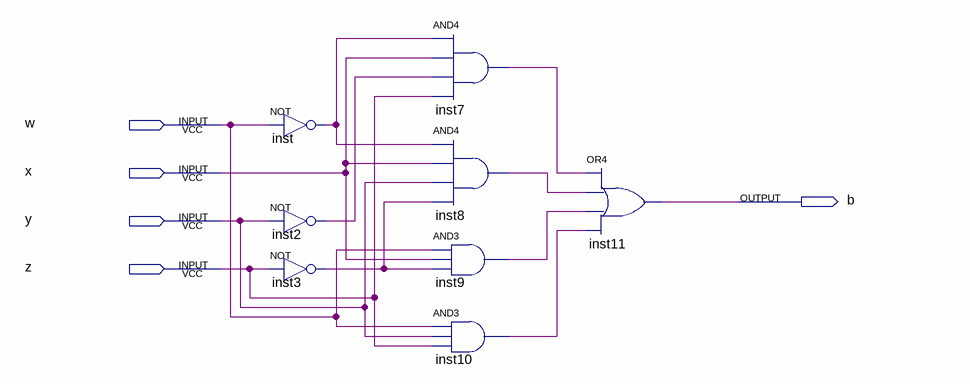
[diagram p0: schematic sheet]
// Quartus schematic B.bdf as structural Verilog: 8 symbols, 5 pins
module B (
  input  w,
  input  x,
  input  y,
  input  z,
  output b
);

  wire inst2_out, inst3_out, inst7_out, inst8_out, inst9_out, inst10_out, inst_out;

  not inst (inst_out, w);
  not inst2 (inst2_out, y);
  not inst3 (inst3_out, z);
  and inst7 (inst7_out, inst_out, x, inst2_out, z);
  and inst8 (inst8_out, inst_out, x, y, inst3_out);
  and inst9 (inst9_out, w, x, inst3_out);
  and inst10 (inst10_out, w, y, z);
  or inst11 (b, inst7_out, inst8_out, inst9_out, inst10_out);
endmodule
